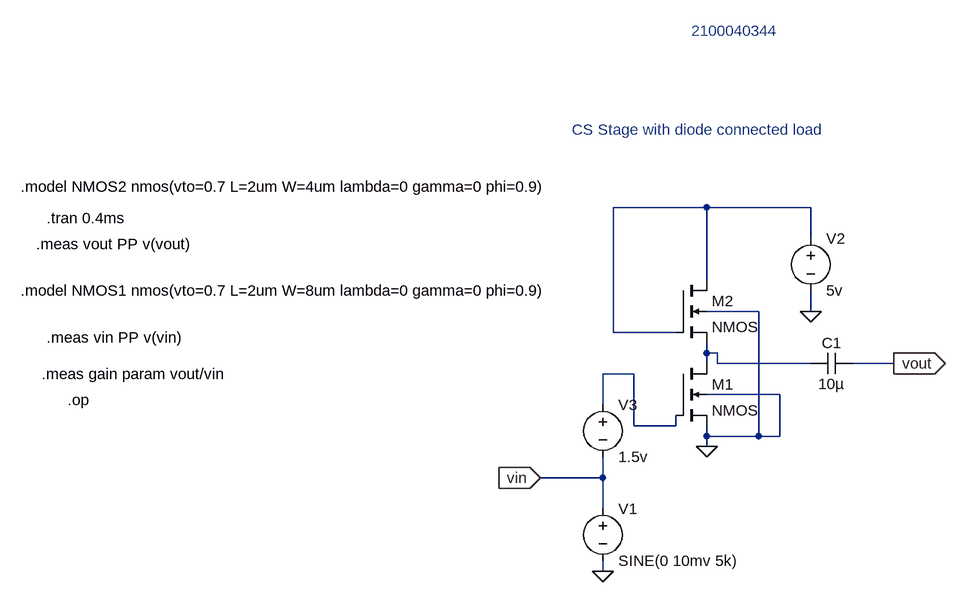
[diagram p0: schematic CS Stage with diode connected load.asc]
CS Stage with diode connected load.asc, the LTspice schematic file:
Version 4
SHEET 1 880 680
WIRE 240 -112 96 -112
WIRE 400 -112 240 -112
WIRE 400 -64 400 -112
WIRE 240 0 240 -112
WIRE 320 48 240 48
WIRE 400 48 400 16
WIRE 96 80 96 -112
WIRE 192 80 96 80
WIRE 240 112 240 96
WIRE 256 112 240 112
WIRE 240 128 240 112
WIRE 256 128 256 112
WIRE 400 128 256 128
WIRE 528 128 464 128
WIRE 128 144 80 144
WIRE 352 176 240 176
WIRE 80 192 80 144
WIRE 128 224 128 144
WIRE 192 224 192 208
WIRE 192 224 128 224
WIRE 240 240 240 224
WIRE 320 240 320 48
WIRE 320 240 240 240
WIRE 352 240 352 176
WIRE 352 240 320 240
WIRE 240 256 240 240
WIRE 80 304 80 272
WIRE 80 304 -16 304
WIRE 80 352 80 304
WIRE 80 448 80 432
FLAG 80 448 0
FLAG 240 256 0
FLAG 400 48 0
FLAG 528 128 vout
IOPIN 528 128 Out
FLAG -16 304 vin
IOPIN -16 304 In
SYMBOL nmos4 192 128 R0
SYMATTR InstName M1
SYMATTR Value2 l=1u w=8u
SYMBOL nmos4 192 0 R0
SYMATTR InstName M2
SYMATTR Value2 l=1u w=1u
SYMBOL voltage 80 336 R0
WINDOW 123 24 124 Left 2
WINDOW 39 0 0 Left 0
SYMATTR InstName V1
SYMATTR Value SINE(0 10mv 5k)
SYMBOL voltage 400 -80 R0
WINDOW 123 0 0 Left 0
WINDOW 39 0 0 Left 0
SYMATTR InstName V2
SYMATTR Value 5v
SYMBOL cap 464 112 R90
WINDOW 0 0 32 VBottom 2
WINDOW 3 32 32 VTop 2
SYMATTR InstName C1
SYMATTR Value 10µ
SYMBOL voltage 80 176 R0
WINDOW 123 0 0 Left 0
WINDOW 39 0 0 Left 0
SYMATTR InstName V3
SYMATTR Value 1.5v
TEXT 32 -232 Left 2 ;CS Stage with diode connected load
TEXT -816 -144 Left 2 !.model NMOS2 nmos(vto=0.7 L=2um W=4um lambda=0 gamma=0 phi=0.9)
TEXT -816 16 Left 2 !.model NMOS1 nmos(vto=0.7 L=2um W=8um lambda=0 gamma=0 phi=0.9)
TEXT -776 -96 Left 2 !.tran 0.4ms
TEXT -792 -56 Left 2 !.meas vout PP v(vout)
TEXT -776 88 Left 2 !.meas vin PP v(vin)
TEXT -784 144 Left 2 !.meas gain param vout/vin
TEXT -744 184 Left 2 !.op
TEXT 216 -384 Left 2 ;2100040344

The netlist it stands for:
* CS Stage with diode connected load.asc
M1 N002 N003 0 0 NMOS l=1u w=8u
M2 N001 N001 N002 0 NMOS l=1u w=1u
V1 vin 0 SINE(0 10mv 5k)
V2 N001 0 5v
C1 vout N002 10µ
V3 N003 vin 1.5v
.model NMOS NMOS
.model PMOS PMOS
.lib standard.mos
* CS Stage with diode connected load
.model NMOS2 nmos(vto=0.7 L=2um W=4um lambda=0 gamma=0 phi=0.9)
.model NMOS1 nmos(vto=0.7 L=2um W=8um lambda=0 gamma=0 phi=0.9)
.tran 0.4ms
.meas vout PP v(vout)
.meas vin PP v(vin)
.meas gain param vout/vin
.op
* 2100040344
.backanno
.end